# Altium schematic sheet Power_Input.SchDoc: Power input
size A4; SheetNumber: 2
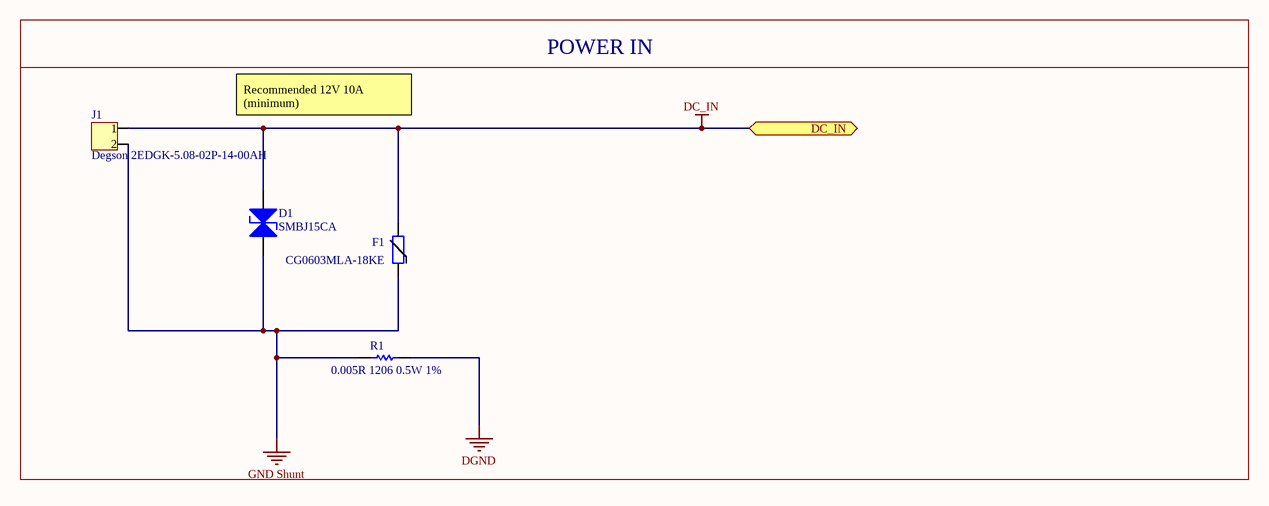
[diagram p0: Power_Input.SchDoc]

## Parts
D1  SMBJ15CA  [PCB-acsqsz06h0bi34fqghyj-1]
F1  CG0603MLA-18KE  [CAPC1608X60X35NL10T15]
J1  Degson 2EDGK-5.08-02P-14-00AH  [PCB-h4cyb3wxd4gf7j132tzl-1]
R1  0.005R 1206 0.5W 1%  [CAPC3216X180X55ML20T25]

## Blocks framed on the sheet
POWER IN: D1 F1 J1 R1

## Ports
DC_IN

## Nets
DC_IN: D1.2(K) F1.2 J1.1 ; port DC_IN
DGND: R1.1
GND Shunt: D1.1(A) F1.1 J1.2 R1.2

## Notes on the sheet
- Recommended 12V 10A (minimum)
- Title
- Size:
- Date:
- A3
- Author:
- Time:
- Revision:
- Sheet
- of
- File:

## Library data of the parts
D1 = CMP-f09b39914f642f5c-1: SMBJ15 Series 24.4 V 600 W Bi-Directional Transient Voltage Suppressor-DO-214AA; Power Dissipation: 5.00 W; Breakdown Voltage: 16.7 V; Power Rating: 600 W; Octopart URL: http://octopart.com/smbj15ca-littelfuse-39577; Mounting Style: Surface Mount; RoHS: Compliant
F1 = CMP-c3730a7940881cb4-1: Var MOV 14VAC 18VDC 30A 24.2V 0603 SMD Paper T/R Var MOV 14VAC 18VDC 30A 24.2V 0603 SMD Paper T/R; Capacitance: 140 pF; Operating Voltage: 14.0 V; Voltage Rating (DC): 18.0 V; Octopart URL: https://octopart.com/cg0603mla-18ke-bourns-42653; Manufacturer Part Number: CG0603MLA-18KE; Case/Package: 0603; Mounting Style: Surface Mount, Solder; Operating Temperature: -55.0 °C (min); Packaging: Reel; REACH SVHC Compliance: No SVHC; RoHS: Compliant; Size-Height: 813 µm; Size-Length: 1.63 mm; Size-Width: 813 µm; Voltage Rating (AC): 14.0 V; OctopartID: c3730a7940881cb4
J1 = CMP-7a42b7ee166ba585-1: Terminal block, 5mm 2 Pos, through hole male.; Manufacturer Part Number: 2EDGK-5.08-02P-14-00AH + 2EDGVC-5.08-02P; Octopart URL: https://octopart.com/2edgk-5.08-02p-14-00ah-degson-78006607; OctopartID: 7a42b7ee166ba585; Manufacturer Part Number 2: WJ2EDGVC-5.08-2P + WJ2EDGK-5.08-2P
R1 = CMP-0abdc173b10ad57a-1: Manufacturer Part Number: WSLP12065L000FEA; Resistance: 0,024; Power: 1W; Octopart URL: https://octopart.com/1-2176055-0-te+connectivity-46440145; Case/Package: 1206; Lifecycle Status: Not Listed by Manufacturer; Packaging: Tape & Reel (TR); OctopartID: 0abdc173b10ad57a; OrderingCode: WSLP12065L000FEA; Manufacturer Part Number 2: FMF06FTHR005-LHL